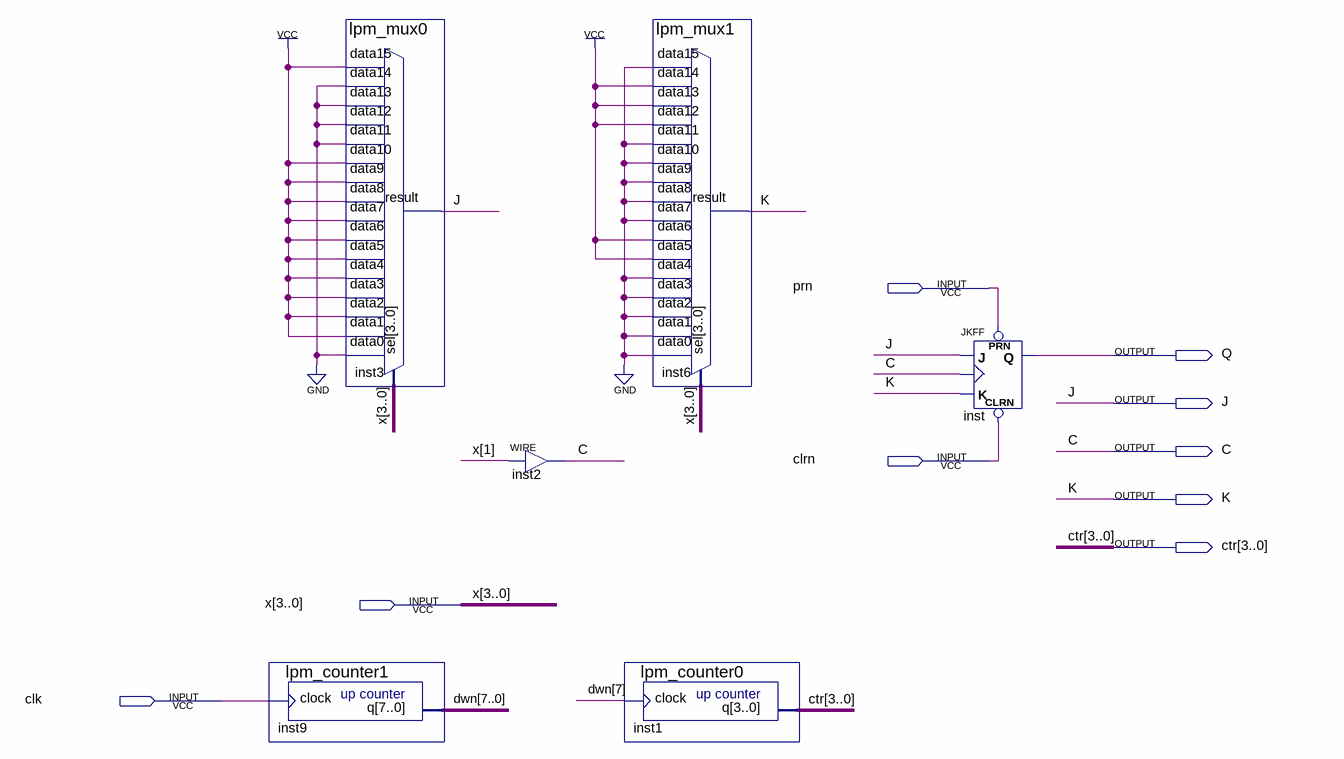
[diagram p0: schematic sheet]
// Quartus schematic lab4JK.bdf as structural Verilog: 6 symbols, 9 pins
module lab4JK (
  input  prn,
  input  clrn,
  input  [3:0] x,
  input  clk,
  output Q,
  output J,
  output C,
  output K,
  output [3:0] ctr
);

  wire [7:0] dwn;

  lpm_counter1 inst9 (.clock(clk), .q(dwn));
  lpm_mux0 inst3 (
    .data15(1'b1), .data14(1'b0), .data13(1'b0), .data12(1'b0), .data11(1'b0), .data10(1'b1), .data9(1'b1),
    .data8(1'b1), .data7(1'b1), .data6(1'b1), .data5(1'b1), .data4(1'b1), .data3(1'b1), .data2(1'b1),
    .data1(1'b1), .data0(1'b0), .sel(x), .result(J));
  assign C = x[1];  // WIRE inst2
  lpm_mux1 inst6 (
    .data15(1'b0), .data14(1'b1), .data13(1'b1), .data12(1'b1), .data11(1'b0), .data10(1'b0), .data9(1'b0),
    .data8(1'b0), .data7(1'b0), .data6(1'b1), .data5(1'b1), .data4(1'b0), .data3(1'b0), .data2(1'b0),
    .data1(1'b0), .data0(1'b0), .sel(x), .result(K));
  lpm_counter0 inst1 (.clock(dwn[7]), .q(ctr));
  JKFF inst (.PRN(prn), .CLRN(clrn), .K(K), .J(J), .CLK(C), .Q(Q));
endmodule
